# Altium schematic sheet GainCHL.SchDoc
size A4
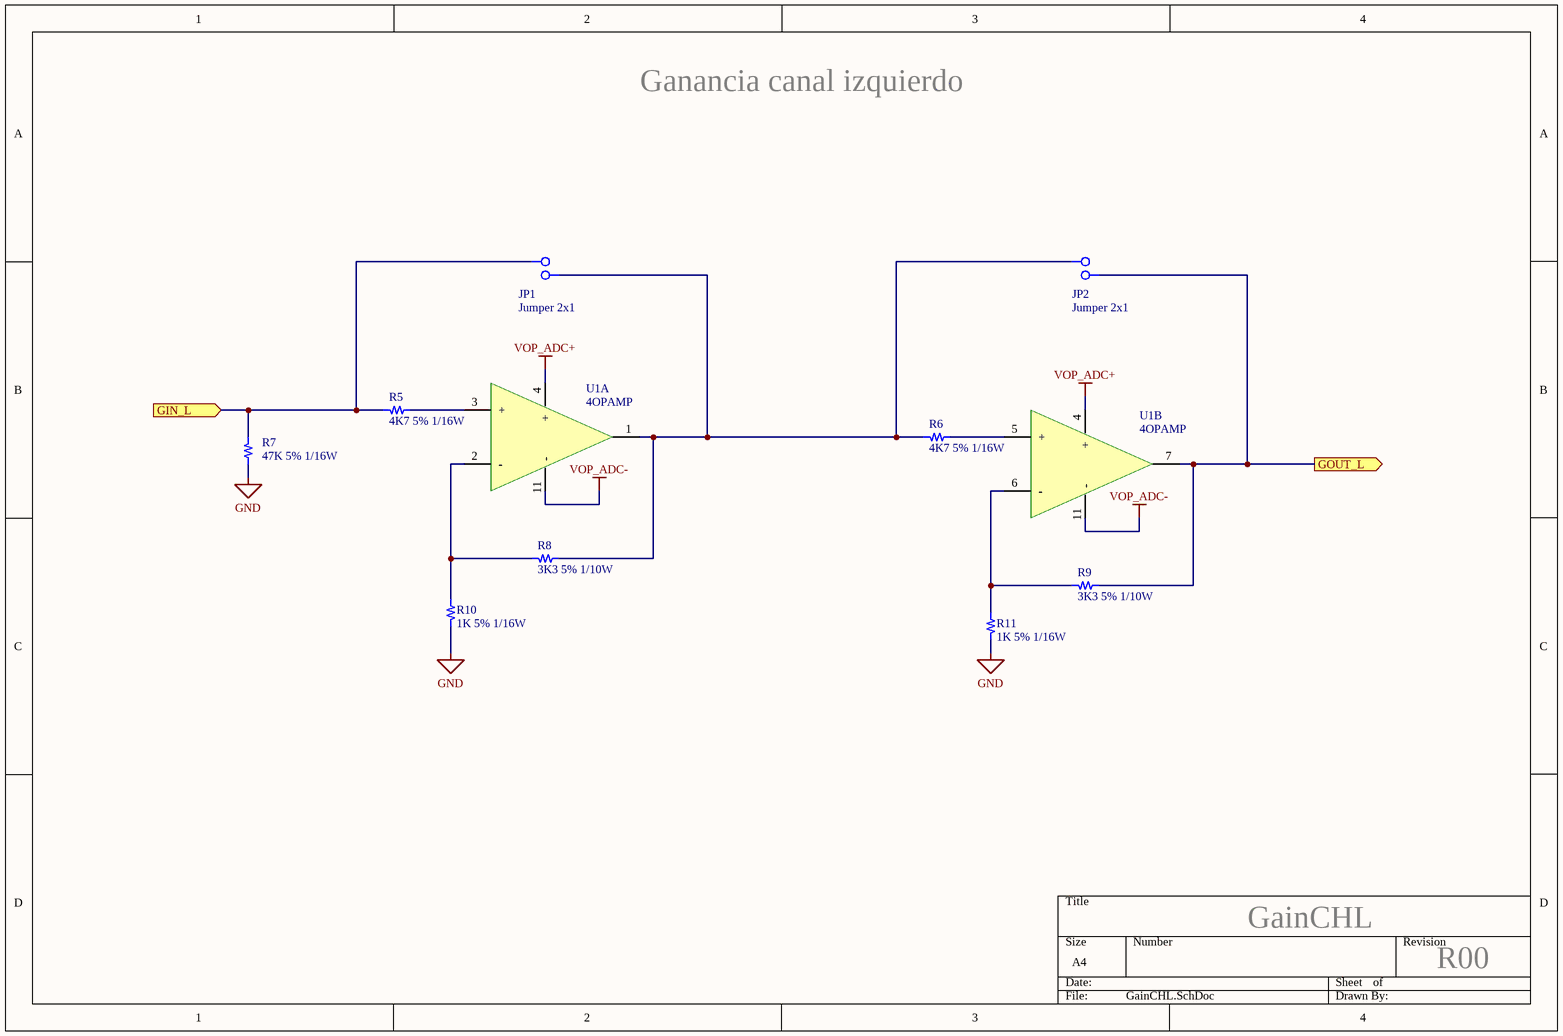
[diagram p0: GainCHL.SchDoc]

## Parts
JP1  Jumper 2x1  [Conn_2_1]
JP2  Jumper 2x1  [Conn_2_1]
R5  4K7 5% 1/16W  [R_0805]
R6  4K7 5% 1/16W  [R_0805]
R7  47K 5% 1/16W  [R_0805]
R8  3K3 5% 1/10W  [R_0805]
R9  3K3 5% 1/10W  [R_0805]
R10  1K 5% 1/16W  [R_0805]
R11  1K 5% 1/16W  [R_0805]
U1  4OPAMP  [SOIC14]  (parts A,B of 4)

## Ports
GIN_L (in), GOUT_L (out)

## Nets
GND: R7.1 R10.2 R11.2
VOP_ADC+: U1.4(+)
VOP_ADC-: U1.11(-)
GIN_L: JP1.1 R5.2 R7.2 ; port GIN_L
GOUT_L: JP2.2 R9.1 U1.7(OUT) ; port GOUT_L
NetJP1_2: JP1.2 JP2.1 R6.2 R8.1 U1.1(OUT)
NetR5_1: R5.1 U1.3(+)
NetR6_1: R6.1 U1.5(+)
NetR8_2: R8.2 R10.1 U1.2(-)
NetR9_2: R9.2 R11.1 U1.6(-)

## Notes on the sheet
- Ganancia canal izquierdo
- GainCHL
- R00

## Library data of the parts
JP1 JP2 = Jumper 2x1: Cod. Proveedor: CO4921360; Proveedor: Elemon
R5 = Resistor: Resistencia; Encapsulado: 0805; Proveedor: Elemon; Cod. Proveedor: RS3896225
R6 = Resistor: Resistencia; Cod. Proveedor: RS3896225; Proveedor: Elemon; Encapsulado: 0805
R7 = Resistor: Resistencia; Encapsulado: 0805; Cod. Proveedor: -; Proveedor: -
R8 R9 = Resistor: Resistencia; Cod. Proveedor: RS3896215; Encapsulado: 0805; Proveedor: Elemon
R10 R11 = Resistor: Resistencia; Cod. Proveedor: RS3866185; Encapsulado: 0603; Proveedor: Elemon
U1 = 4OPAMP: Integrado con 4 operacionales; Cod. Proveedor: -; Proveedor: -; Encapsulado: SOIC14